# EAGLE design rx_switch (EAGLE 6.1)
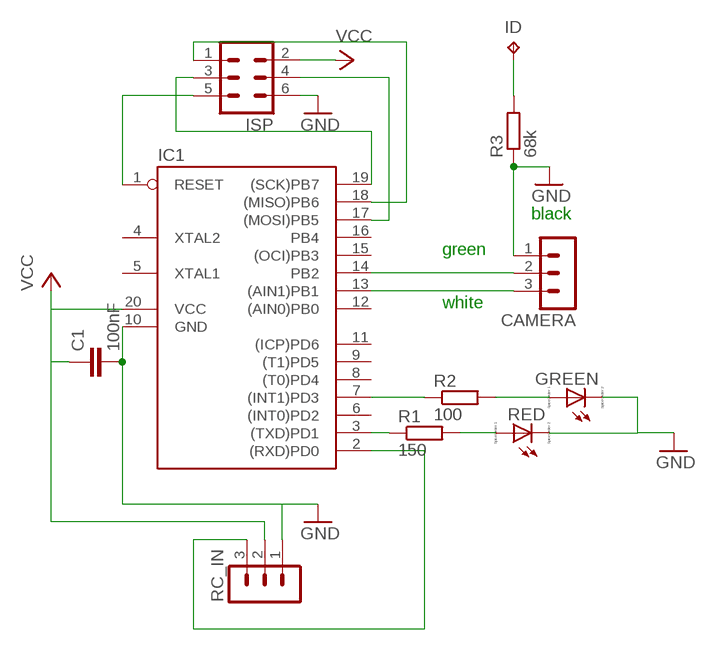
[diagram p0: schematic, sheet 1]

## Parts
C1  100nF  C-EUC0805  [C0805]
CAMERA  MA03-1  [MA03-1]
GREEN  LED_E  [LED_1206]
IC1  AT90S2313S  [SO20L]
ID  TPPAD1-13  [P1-13]
ISP  MA03-2  [MA03-2]
R1  150  R-EU_R1206  [R1206]
R2  100  R-EU_R1206  [R1206]
R3  68k  R-EU_R1206  [R1206]
RC_IN  MA03-1  [MA03-1]
RED  LED_E  [LED_1206]

## Nets
GND: C1.2 CAMERA.1 GREEN.C IC1.10(GND) ISP.6 R3.1 RC_IN.1 RED.C
ISP: IC1.19((SCK)PB7) ISP.3
N$1: IC1.1(RESET) ISP.5
N$2: IC1.17((MOSI)PB5) ISP.4
N$3: IC1.2((RXD)PD0) RC_IN.3
N$4: CAMERA.2 IC1.14(PB2)
N$5: CAMERA.3 IC1.13((AIN1)PB1)
N$6: IC1.18((MISO)PB6) ISP.1
N$7: ID.TP R3.2
N$8: R1.2 RED.A
N$9: IC1.7((INT1)PD3) R2.1
N$10: IC1.3((TXD)PD1) R1.1
N$11: GREEN.A R2.2
VCC: C1.1 IC1.20(VCC) ISP.2 RC_IN.2
Unconnected: IC1.4(XTAL2) IC1.5(XTAL1) IC1.6((INT0)PD2) IC1.8((T0)PD4) IC1.9((T1)PD5) IC1.11((ICP)PD6) IC1.12((AIN0)PB0) IC1.15((OCI)PB3) IC1.16(PB4)

## Notes on the sheet
- black
- green
- white

## Library data of the parts
C1 = rcl:C-EU: CAPACITOR, European symbol
CAMERA RC_IN = con-lstb:MA03-1: PIN HEADER; OC_FARNELL: unknown; OC_NEWARK: unknown
GREEN RED = eagle-ltspice:LED_E: LED Source: http://www.osram.convergy.de Source: www.luxeon.com Source: www.kingbright.com; SPICEMODEL: NONE; SPICEPREFIX: D; SPICETYPE: diode
IC1 = atmel:AT90S2313: MICROCONTROLLER 2 Kbytes FLASH 128 bytes SRAM 128 bytes EEPROM UART; OC_FARNELL: unknown; OC_NEWARK: unknown
ID = testpad:TP: Test pad
ISP = con-lstb:MA03-2: PIN HEADER; OC_FARNELL: unknown; OC_NEWARK: unknown
R1-R3 = rcl:R-EU_: RESISTOR, European symbol

## Board
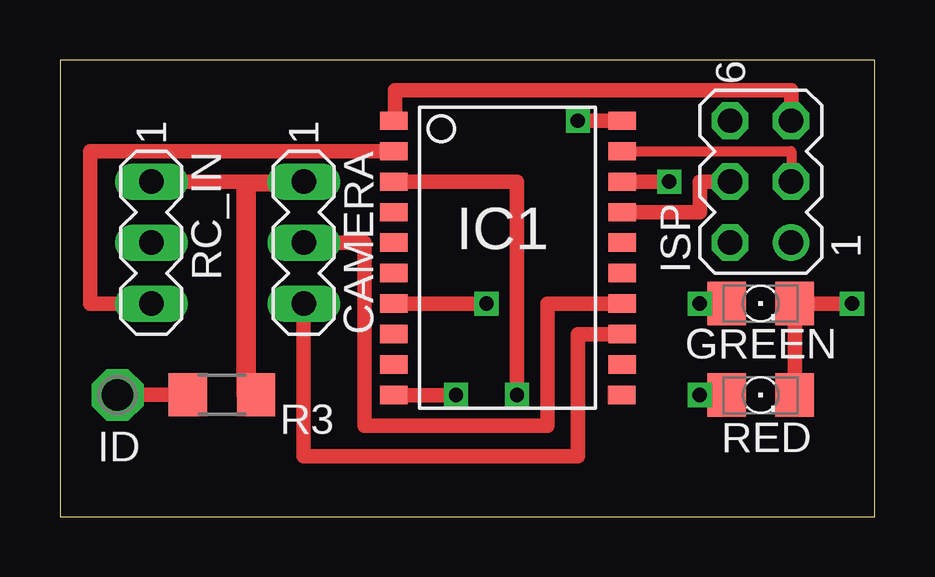
[diagram p1: board, top side]
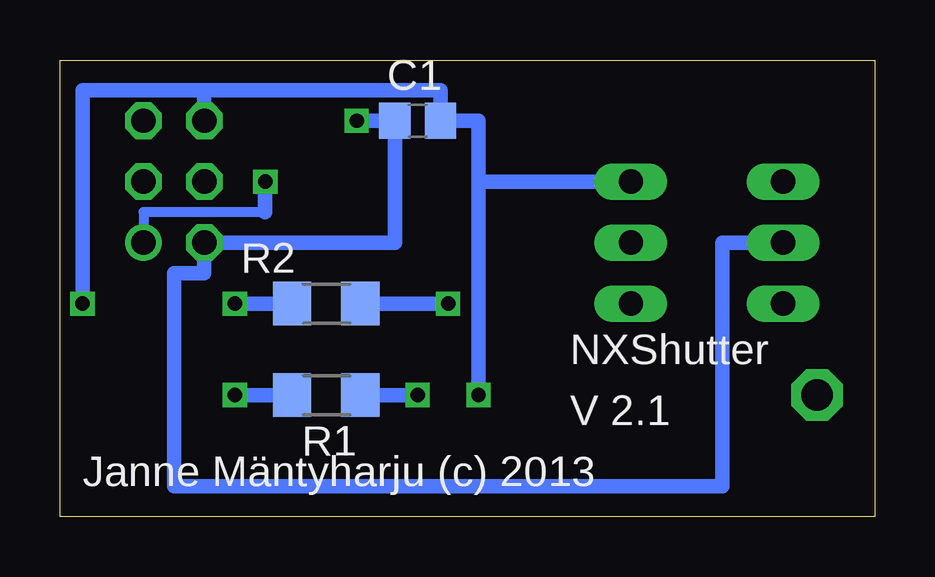
[diagram p2: board, bottom side, seen from below]

Size 33.96 x 19.04 mm. Coordinates in mm from the lower left corner, seen from the top.
Outline: 0,0 33.96,0 33.96,19.04 0,19.04 0,0
Copper layers (1*16): Top 0.035mm / dielectric 1.5mm / Bottom 0.035mm
Design rules: minimum track width 10mil, minimum drill 24mil, track to track 8mil, track to pad 8mil, pad to pad 8mil, via to via 8mil, smd to smd 8mil, copper to edge 40mil, drill to drill 8mil, minimum pad ring 10mil, minimum via ring 8mil, stop-mask expansion 4mil, vias tented up to drill 0mil, thermal gap 10mil

### Footprints (pad centres in the part's own frame; a part is rotated, then mirrored left to right if it is on the bottom)
C0805 = smd 1.3 x 1.5: 1 -0.95,0; 2 0.95,0
MA03-1 = drill 1.016 long: 1 -2.54,0; 2 0,0; 3 2.54,0
LED_1206 = smd 1.6 x 1.803: A -1.422,0; C 1.422,0
SO20L = smd 0.762 x 1.143: 1 -5.08,-5.131; 2 -3.81,-5.131; 3 -2.54,-5.131; 4 -1.27,-5.131; 5 0,-5.131; 6 1.27,-5.131; 7 2.54,-5.131; 8 3.81,-5.131; 9 5.08,-5.131; 10 6.35,-5.131; 11 6.35,4.369; 12 5.08,4.394; 13 3.81,4.394; 14 2.54,4.394; 15 1.27,4.394; 16 0,4.394; 17 -1.27,4.394; 18 -2.54,4.394; 19 -3.81,4.394; 20 -5.08,4.394
P1-13 = drill 1.321 pad 2.159 octagon: TP 0,0
MA03-2 = drill 1.016: 1 -2.54,-1.27 | drill 1.016 octagon: 2 -2.54,1.27; 3 0,-1.27; 4 0,1.27; 5 2.54,-1.27; 6 2.54,1.27
R1206 = smd 1.6 x 1.803: 1 -1.422,0; 2 1.422,0

### Placement (x,y rotation side)
C1  19.05,16.51 0 bottom
CAMERA  10.16,11.43 270 top
GREEN  29.21,8.89 0 top
IC1  19.05,11.43 270 top
ID  2.4,5.09 0 top
ISP  29.21,13.97 90 top
R1  22.86,5.08 180 bottom
R2  22.86,8.89 180 bottom
R3  6.76,5.09 180 top
RC_IN  3.81,11.43 270 top
RED  29.21,5.08 0 top

### Tracks (layer width: path | path; a pad name or v marks a point on that pad's centre or on a via)
GND  (via drill 0.6)
  Top 0.61: RC_IN.1 CAMERA.1 10.16,13.87 7.75,13.87 | RED.C GREEN.C v33.02,8.89 | v16.51,5.08 IC1.10
  Top 0.813: R3.1 7.75,5.09 7.75,13.87
  Bottom 0.61: CAMERA.1 16.51,13.97 | 16.51,13.97 v16.51,5.08 | 16.51,13.97 16.51,16.51 C1.2 18.1,17.78 27.94,17.78 | v33.02,8.89 33.02,17.78 27.94,17.78 | 27.94,17.78 ISP.6
ISP
  Top 0.406: IC1.19 30.48,15.24 ISP.3
N$1
  Top 0.61: IC1.1 13.97,16.51 13.97,17.78 30.48,17.78 ISP.5
N$2
  Top 0.61: ISP.4 26.67,13.97 26.67,12.7 IC1.17
N$3
  Top 0.61: IC1.2 1.27,15.24 1.27,8.89 RC_IN.3
N$4
  Top 0.61: IC1.14 20.32,8.89 20.32,3.81 12.7,3.81 12.7,11.43 CAMERA.2
N$5
  Top 0.61: CAMERA.3 10.16,2.54 21.59,2.54 21.59,7.62 IC1.13
N$6  (via drill 0.6)
  Top 0.61: IC1.18 v25.4,13.97
  Bottom 0.406: 25.4,12.7 30.48,12.7 ISP.1
  Bottom 0.61: v25.4,13.97 25.4,12.7
N$7
  Top 0.61: R3.2 ID.TP
N$8  (via drill 0.6)
  Top 0.61: RED.A v26.67,5.08
  Bottom 0.61: v26.67,5.08 R1.2
N$9  (via drill 0.6)
  Top 0.61: v17.78,8.89 IC1.7
  Bottom 0.61: R2.1 v17.78,8.89
N$10  (via drill 0.6)
  Top 0.61: IC1.3 19.05,13.97 v19.05,5.08
  Bottom 0.61: v19.05,5.08 R1.1
N$11  (via drill 0.6)
  Top 0.61: GREEN.A v26.67,8.89
  Bottom 0.61: v26.67,8.89 R2.2
VCC  (via drill 0.6)
  Top 0.61: v21.59,16.51 IC1.20
  Bottom 0.61: RC_IN.2 6.35,11.43 6.35,1.27 29.21,1.27 29.21,10.16 27.94,10.16 ISP.2 20,11.43 C1.1 v21.59,16.51

### Text on the board
bNames: NXShutter | V 2.1 | Janne Mäntyharju (c) 2013